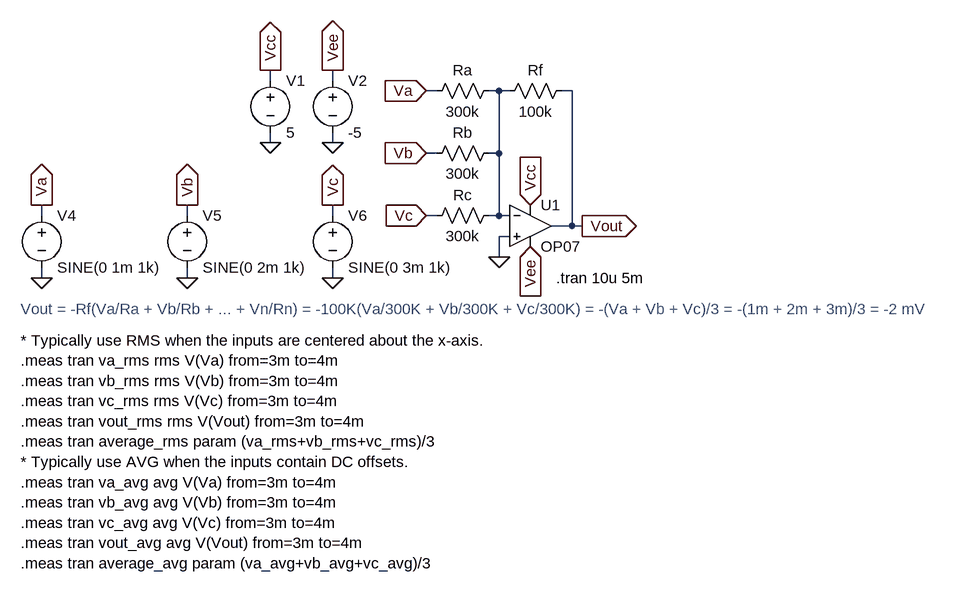
[diagram p0: schematic op-amp_inverting_summing_amplifier.asc]
op-amp_inverting_summing_amplifier.asc, the LTspice schematic file:
Version 4
SHEET 1 1176 752
WIRE 48 96 48 80
WIRE 144 96 144 80
WIRE 304 112 288 112
WIRE 400 112 384 112
WIRE 416 112 400 112
WIRE 512 112 496 112
WIRE 48 192 48 176
WIRE 144 192 144 176
WIRE 304 208 288 208
WIRE 400 208 400 112
WIRE 400 208 384 208
WIRE -304 304 -304 288
WIRE -80 304 -80 288
WIRE 144 304 144 288
WIRE 304 304 288 304
WIRE 400 304 400 208
WIRE 400 304 384 304
WIRE 416 304 400 304
WIRE 512 320 512 112
WIRE 512 320 480 320
WIRE 528 320 512 320
WIRE 416 336 400 336
WIRE 400 368 400 336
WIRE -304 400 -304 384
WIRE -80 400 -80 384
WIRE 144 400 144 384
FLAG 448 288 Vcc
IOPIN 448 288 In
FLAG 448 352 Vee
IOPIN 448 352 In
FLAG 288 304 Vc
IOPIN 288 304 In
FLAG 528 320 Vout
IOPIN 528 320 Out
FLAG 48 192 0
FLAG 144 192 0
FLAG 48 80 Vcc
IOPIN 48 80 Out
FLAG 144 80 Vee
IOPIN 144 80 Out
FLAG 400 368 0
FLAG 288 112 Va
IOPIN 288 112 In
FLAG 288 208 Vb
IOPIN 288 208 In
FLAG -304 400 0
FLAG -80 400 0
FLAG 144 400 0
FLAG -304 288 Va
IOPIN -304 288 Out
FLAG -80 288 Vb
IOPIN -80 288 Out
FLAG 144 288 Vc
IOPIN 144 288 Out
SYMBOL OpAmps/OP07 448 256 R0
SYMATTR InstName U1
SYMBOL res 512 96 R90
WINDOW 0 0 56 VBottom 2
WINDOW 3 32 56 VTop 2
SYMATTR InstName Rf
SYMATTR Value 100k
SYMBOL voltage 48 80 R0
SYMATTR InstName V1
SYMATTR Value 5
SYMBOL voltage 144 80 R0
SYMATTR InstName V2
SYMATTR Value -5
SYMBOL res 400 288 R90
WINDOW 0 0 56 VBottom 2
WINDOW 3 32 56 VTop 2
SYMATTR InstName Rc
SYMATTR Value 300k
SYMBOL res 400 192 R90
WINDOW 0 0 56 VBottom 2
WINDOW 3 32 56 VTop 2
SYMATTR InstName Rb
SYMATTR Value 300k
SYMBOL res 400 96 R90
WINDOW 0 0 56 VBottom 2
WINDOW 3 32 56 VTop 2
SYMATTR InstName Ra
SYMATTR Value 300k
SYMBOL voltage -304 288 R0
SYMATTR InstName V4
SYMATTR Value SINE(0 1m 1k)
SYMBOL voltage -80 288 R0
SYMATTR InstName V5
SYMATTR Value SINE(0 2m 1k)
SYMBOL voltage 144 288 R0
SYMATTR InstName V6
SYMATTR Value SINE(0 3m 1k)
TEXT -336 496 Left 2 !* Typically use RMS when the inputs are centered about the x-axis.\n.meas tran va_rms rms V(Va) from=3m to=4m\n.meas tran vb_rms rms V(Vb) from=3m to=4m\n.meas tran vc_rms rms V(Vc) from=3m to=4m\n.meas tran vout_rms rms V(Vout) from=3m to=4m\n.meas tran average_rms param (va_rms+vb_rms+vc_rms)/3\n* Typically use AVG when the inputs contain DC offsets.\n.meas tran va_avg avg V(Va) from=3m to=4m\n.meas tran vb_avg avg V(Vb) from=3m to=4m\n.meas tran vc_avg avg V(Vc) from=3m to=4m\n.meas tran vout_avg avg V(Vout) from=3m to=4m\n.meas tran average_avg param (va_avg+vb_avg+vc_avg)/3
TEXT -336 448 Left 2 ;Vout = -Rf(Va/Ra + Vb/Rb + ... + Vn/Rn) = -100K(Va/300K + Vb/300K + Vc/300K) = -(Va + Vb + Vc)/3 = -(1m + 2m + 3m)/3 = -2 mV
TEXT 488 400 Left 2 !.tran 10u 5m

The netlist it stands for:
* op-amp_inverting_summing_amplifier.asc
XU1 0 N001 Vcc Vee Vout LT1001  ; OP07, pins In+ In- V+ V- OUT
Rf Vout N001 100k
V1 Vcc 0 5
V2 Vee 0 -5
Rc N001 Vc 300k
Rb N001 Vb 300k
Ra N001 Va 300k
V4 Va 0 SINE(0 1m 1k)
V5 Vb 0 SINE(0 2m 1k)
V6 Vc 0 SINE(0 3m 1k)
* Typically use RMS when the inputs are centered about the x-axis.
.meas tran va_rms rms V(Va) from=3m to=4m
.meas tran vb_rms rms V(Vb) from=3m to=4m
.meas tran vc_rms rms V(Vc) from=3m to=4m
.meas tran vout_rms rms V(Vout) from=3m to=4m
.meas tran average_rms param (va_rms+vb_rms+vc_rms)/3
* Typically use AVG when the inputs contain DC offsets.
.meas tran va_avg avg V(Va) from=3m to=4m
.meas tran vb_avg avg V(Vb) from=3m to=4m
.meas tran vc_avg avg V(Vc) from=3m to=4m
.meas tran vout_avg avg V(Vout) from=3m to=4m
.meas tran average_avg param (va_avg+vb_avg+vc_avg)/3
* Vout = -Rf(Va/Ra + Vb/Rb + ... + Vn/Rn) = -100K(Va/300K + Vb/300K + Vc/300K) = -(Va + Vb + Vc)/3 = -(1m + 2m + 3m)/3 = -2 mV
.tran 10u 5m
.lib LTC.lib
.backanno
.end